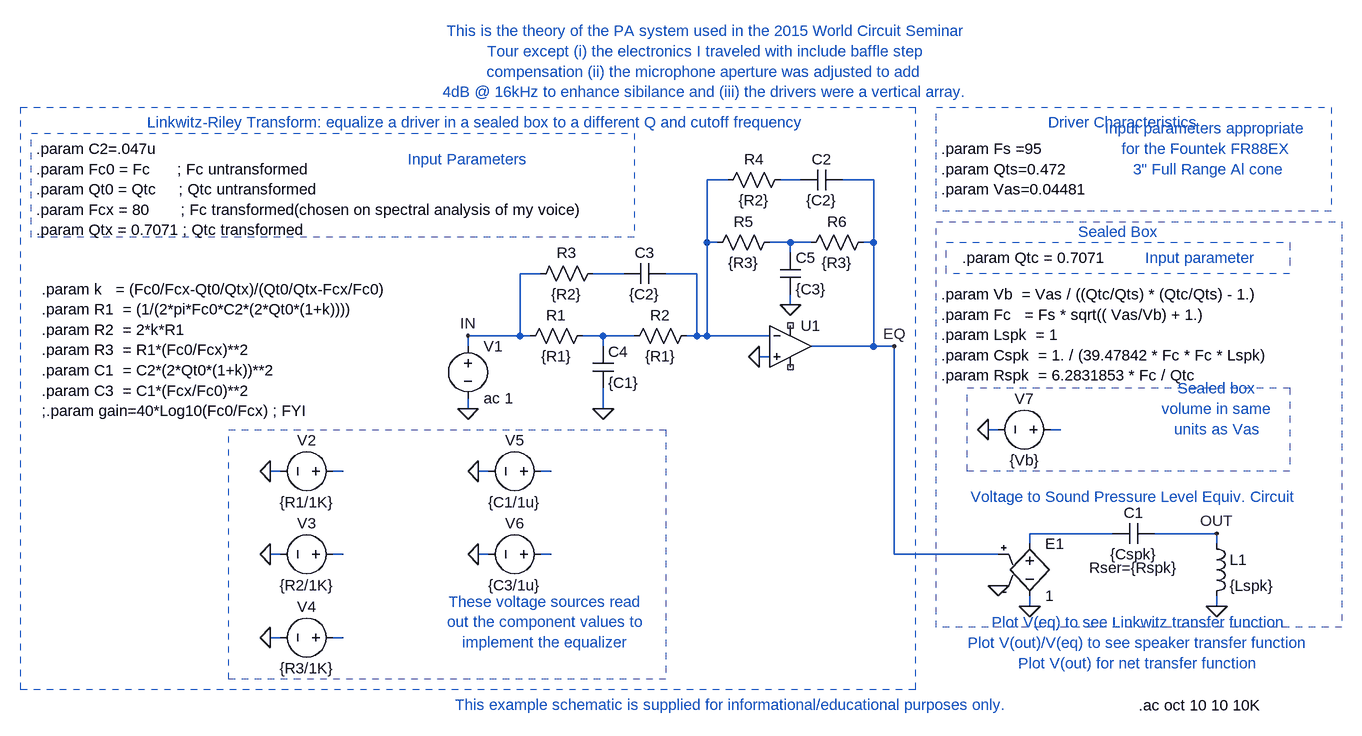
[diagram p0: schematic Linkwitz.asc]
Linkwitz.asc, the LTspice schematic file:
Version 4
SHEET 1 3960 2816
WIRE -192 1200 -224 1200
WIRE -80 1200 -112 1200
WIRE 32 1200 -16 1200
WIRE -224 1296 -224 1200
WIRE -208 1296 -224 1296
WIRE -96 1296 -128 1296
WIRE -64 1296 -96 1296
WIRE 32 1296 32 1200
WIRE 32 1296 16 1296
WIRE -96 1312 -96 1296
WIRE -480 1344 -512 1344
WIRE -352 1344 -400 1344
WIRE -240 1344 -288 1344
WIRE -96 1392 -96 1376
WIRE -512 1440 -512 1344
WIRE -512 1440 -592 1440
WIRE -496 1440 -512 1440
WIRE -384 1440 -416 1440
WIRE -336 1440 -384 1440
WIRE -240 1440 -240 1344
WIRE -240 1440 -256 1440
WIRE -224 1440 -224 1296
WIRE -224 1440 -240 1440
WIRE -128 1440 -224 1440
WIRE -592 1456 -592 1440
WIRE -384 1456 -384 1440
WIRE 32 1456 32 1296
WIRE 32 1456 -64 1456
WIRE 64 1456 32 1456
WIRE -128 1472 -144 1472
WIRE -592 1552 -592 1536
WIRE -384 1552 -384 1520
WIRE 224 1584 208 1584
WIRE 320 1584 304 1584
WIRE -880 1648 -896 1648
WIRE -784 1648 -800 1648
WIRE -560 1648 -576 1648
WIRE -464 1648 -480 1648
WIRE 400 1744 272 1744
WIRE 560 1744 464 1744
WIRE 272 1760 272 1744
WIRE 560 1760 560 1744
WIRE -880 1776 -896 1776
WIRE -784 1776 -800 1776
WIRE -560 1776 -576 1776
WIRE -464 1776 -480 1776
WIRE 64 1776 64 1456
WIRE 224 1776 64 1776
WIRE 272 1856 272 1840
WIRE 560 1856 560 1840
WIRE -880 1904 -896 1904
WIRE -784 1904 -800 1904
FLAG 224 1824 0
FLAG 272 1856 0
FLAG 560 1744 OUT
FLAG 560 1856 0
FLAG -592 1552 0
FLAG -96 1392 0
FLAG -384 1552 0
FLAG -144 1472 0
FLAG -896 1648 0
FLAG -896 1776 0
FLAG -896 1904 0
FLAG -576 1648 0
FLAG -576 1776 0
FLAG 64 1456 EQ
FLAG 208 1584 0
FLAG -592 1440 IN
DATAFLAG -784 1648 ""
DATAFLAG -784 1776 ""
DATAFLAG -784 1904 ""
DATAFLAG -464 1648 ""
DATAFLAG -464 1776 ""
DATAFLAG 320 1584 ""
SYMBOL e 272 1744 R0
SYMATTR InstName E1
SYMATTR Value 1
SYMBOL cap 464 1728 R90
WINDOW 0 0 32 VBottom 2
WINDOW 3 32 32 VTop 2
WINDOW 123 53 32 VTop 2
SYMATTR InstName C1
SYMATTR Value {Cspk}
SYMATTR Value2 Rser={Rspk}
SYMBOL ind 544 1744 R0
SYMATTR InstName L1
SYMATTR Value {Lspk}
SYMATTR SpiceLine Rser=0
SYMBOL voltage -592 1440 R0
SYMATTR InstName V1
SYMATTR Value ac 1
SYMBOL res -400 1424 R90
WINDOW 0 0 56 VBottom 2
WINDOW 3 32 56 VTop 2
SYMATTR InstName R1
SYMATTR Value {R1}
SYMBOL res -240 1424 R90
WINDOW 0 0 56 VBottom 2
WINDOW 3 32 56 VTop 2
SYMATTR InstName R2
SYMATTR Value {R1}
SYMBOL res -384 1328 R90
WINDOW 0 0 56 VBottom 2
WINDOW 3 32 56 VTop 2
SYMATTR InstName R3
SYMATTR Value {R2}
SYMBOL res -96 1184 R90
WINDOW 0 0 56 VBottom 2
WINDOW 3 32 56 VTop 2
SYMATTR InstName R4
SYMATTR Value {R2}
SYMBOL res -112 1280 R90
WINDOW 0 0 56 VBottom 2
WINDOW 3 32 56 VTop 2
SYMATTR InstName R5
SYMATTR Value {R3}
SYMBOL res 32 1280 R90
WINDOW 0 0 56 VBottom 2
WINDOW 3 32 56 VTop 2
SYMATTR InstName R6
SYMATTR Value {R3}
SYMBOL cap -16 1184 R90
WINDOW 0 0 32 VBottom 2
WINDOW 3 32 32 VTop 2
SYMATTR InstName C2
SYMATTR Value {C2}
SYMBOL cap -288 1328 R90
WINDOW 0 0 32 VBottom 2
WINDOW 3 32 32 VTop 2
SYMATTR InstName C3
SYMATTR Value {C2}
SYMBOL cap -400 1456 R0
SYMATTR InstName C4
SYMATTR Value {C1}
SYMBOL cap -112 1312 R0
SYMATTR InstName C5
SYMATTR Value {C3}
SYMBOL voltage -784 1648 R90
WINDOW 0 -32 56 VBottom 2
WINDOW 3 32 56 VTop 2
SYMATTR InstName V2
SYMATTR Value {R1/1K}
SYMBOL voltage -784 1776 R90
WINDOW 0 -32 56 VBottom 2
WINDOW 3 32 56 VTop 2
SYMATTR InstName V3
SYMATTR Value {R2/1K}
SYMBOL voltage -784 1904 R90
WINDOW 0 -32 56 VBottom 2
WINDOW 3 32 56 VTop 2
SYMATTR InstName V4
SYMATTR Value {R3/1K}
SYMBOL voltage -464 1648 R90
WINDOW 0 -32 56 VBottom 2
WINDOW 3 32 56 VTop 2
SYMATTR InstName V5
SYMATTR Value {C1/1u}
SYMBOL voltage -464 1776 R90
WINDOW 0 -32 56 VBottom 2
WINDOW 3 32 56 VTop 2
SYMATTR InstName V6
SYMATTR Value {C3/1u}
SYMBOL voltage 320 1584 R90
WINDOW 0 -32 56 VBottom 2
WINDOW 3 32 56 VTop 2
SYMATTR InstName V7
SYMATTR Value {Vb}
SYMBOL opamps\\UniversalOpamp2 -96 1456 R0
SYMATTR InstName U1
SYMATTR SpiceModel level.1
TEXT 136 1376 Left 2 !.param Vb  = Vas / ((Qtc/Qts) * (Qtc/Qts) - 1.)\n.param Fc   = Fs * sqrt(( Vas/Vb) + 1.) \n.param Lspk  = 1\n.param Cspk  = 1. / (39.47842 * Fc * Fc * Lspk)\n.param Rspk  = 6.2831853 * Fc / Qtc
TEXT 136 1152 Left 2 !.param Fs =95\n.param Qts=0.472\n.param Vas=0.04481
TEXT 440 2008 Left 2 !.ac oct 10 10 10K
TEXT -1248 1368 Left 2 !.param k   = (Fc0/Fcx-Qt0/Qtx)/(Qt0/Qtx-Fcx/Fc0)\n.param R1  = (1/(2*pi*Fc0*C2*(2*Qt0*(1+k))))\n.param R2  = 2*k*R1\n.param R3  = R1*(Fc0/Fcx)**2\n.param C1  = C2*(2*Qt0*(1+k))**2\n.param C3  = C1*(Fcx/Fc0)**2\n;.param gain=40*Log10(Fc0/Fcx) ; FYI
TEXT -576 1096 Top 2 ;Linkwitz-Riley Transform: equalize a driver in a sealed box to a different Q and cutoff frequency
TEXT 416 1096 Top 2 ;Driver Characteristics
TEXT 408 1264 Top 2 ;Sealed Box
TEXT 440 1912 Center 2 ;Plot V(eq) to see Linkwitz transfer function\nPlot V(out)/V(eq) to see speaker transfer function\nPlot V(out) for net transfer function
TEXT 432 1672 Top 2 ;Voltage to Sound Pressure Level Equiv. Circuit
TEXT -184 1992 Top 2 ;This example schematic is supplied for informational/educational purposes only.
TEXT -224 1080 Bottom 2 ;This is the theory of the PA system used in the 2015 World Circuit Seminar\nTour except (i) the electronics I traveled with include baffle step\ncompensation (ii) the microphone aperture was adjusted to add\n4dB @ 16kHz to enhance sibilance and (iii) the drivers were a vertical array.
TEXT -472 1880 Center 2 ;These voltage sources read\nout the component values to\nimplement the equalizer
TEXT 560 1552 Center 2 ;Sealed box\nvolume in same\nunits as Vas
TEXT -592 1168 Center 2 ;Input Parameters
TEXT 168 1320 Left 2 !.param Qtc = 0.7071
TEXT 536 1320 Center 2 ;Input parameter
TEXT 544 1152 Center 2 ;Input parameters appropriate\nfor the Fountek FR88EX\n 3" Full Range Al cone
TEXT -1256 1152 Left 2 !.param C2=.047u\n.param Fc0 = Fc      ; Fc untransformed\n.param Qt0 = Qtc     ; Qtc untransformed\n.param Fcx = 80       ; Fc transformed(chosen on spectral analysis of my voice)\n.param Qtx = 0.7071 ; Qtc transformed
RECTANGLE Normal 96 1984 -1280 1088 2
RECTANGLE Normal -288 1968 -960 1584 2
RECTANGLE Normal 672 1648 176 1520 2
RECTANGLE Normal 672 1344 144 1296 2
RECTANGLE Normal 736 1248 128 1088 2
RECTANGLE Normal 752 1888 128 1264 2
RECTANGLE Normal -336 1288 -1264 1128 2

The netlist it stands for:
* Linkwitz.asc
E1 N009 0 EQ 0 1
C1 OUT N009 {Cspk} Rser={Rspk}
L1 OUT 0 {Lspk} Rser=0
V1 IN 0 ac 1
R1 N005 IN {R1}
R2 N001 N005 {R1}
R3 N004 IN {R2}
R4 N002 N001 {R2}
R5 N003 N001 {R3}
R6 EQ N003 {R3}
C2 EQ N002 {C2}
C3 N001 N004 {C2}
C4 N005 0 {C1}
C5 N003 0 {C3}
V2 N007 0 {R1/1K}
V3 N010 0 {R2/1K}
V4 N012 0 {R3/1K}
V5 N008 0 {C1/1u}
V6 N011 0 {C3/1u}
V7 N006 0 {Vb}
XU1 0 N001 NC_01 NC_02 EQ level.1 Avol=1Meg GBW=10Meg Slew=10Meg ilimit=25m rail=0 Vos=0 phimargin=45 en=0 enk=0 in=0 ink=0 Rin=500Meg  ; pins IN+ IN- V+ V- OUT
.param Vb  = Vas / ((Qtc/Qts) * (Qtc/Qts) - 1.)
.param Fc   = Fs * sqrt(( Vas/Vb) + 1.)
.param Lspk  = 1
.param Cspk  = 1. / (39.47842 * Fc * Fc * Lspk)
.param Rspk  = 6.2831853 * Fc / Qtc
.param Fs =95
.param Qts=0.472
.param Vas=0.04481
.ac oct 10 10 10K
.param k   = (Fc0/Fcx-Qt0/Qtx)/(Qt0/Qtx-Fcx/Fc0)
.param R1  = (1/(2*pi*Fc0*C2*(2*Qt0*(1+k))))
.param R2  = 2*k*R1
.param R3  = R1*(Fc0/Fcx)**2
.param C1  = C2*(2*Qt0*(1+k))**2
.param C3  = C1*(Fcx/Fc0)**2
;.param gain=40*Log10(Fc0/Fcx) ; FYI
* Linkwitz-Riley Transform: equalize a driver in a sealed box to a different Q and cutoff frequency
* Driver Characteristics
* Sealed Box
* Plot V(eq) to see Linkwitz transfer function
* Plot V(out)/V(eq) to see speaker transfer function
* Plot V(out) for net transfer function
* Voltage to Sound Pressure Level Equiv. Circuit
* This example schematic is supplied for informational/educational purposes only.
* This is the theory of the PA system used in the 2015 World Circuit Seminar
* Tour except (i) the electronics I traveled with include baffle step
* compensation (ii) the microphone aperture was adjusted to add
* 4dB @ 16kHz to enhance sibilance and (iii) the drivers were a vertical array.
* These voltage sources read
* out the component values to
* implement the equalizer
* Sealed box
* volume in same
* units as Vas
* Input Parameters
.param Qtc = 0.7071
* Input parameter
* Input parameters appropriate
* for the Fountek FR88EX
*  3" Full Range Al cone
.param C2=.047u
.param Fc0 = Fc      ; Fc untransformed
.param Qt0 = Qtc     ; Qtc untransformed
.param Fcx = 80       ; Fc transformed(chosen on spectral analysis of my voice)
.param Qtx = 0.7071 ; Qtc transformed
.lib UniversalOpamps2.sub
.backanno
.end